# EAGLE board flipchip (EAGLE 6.6.0), part 1 of 2
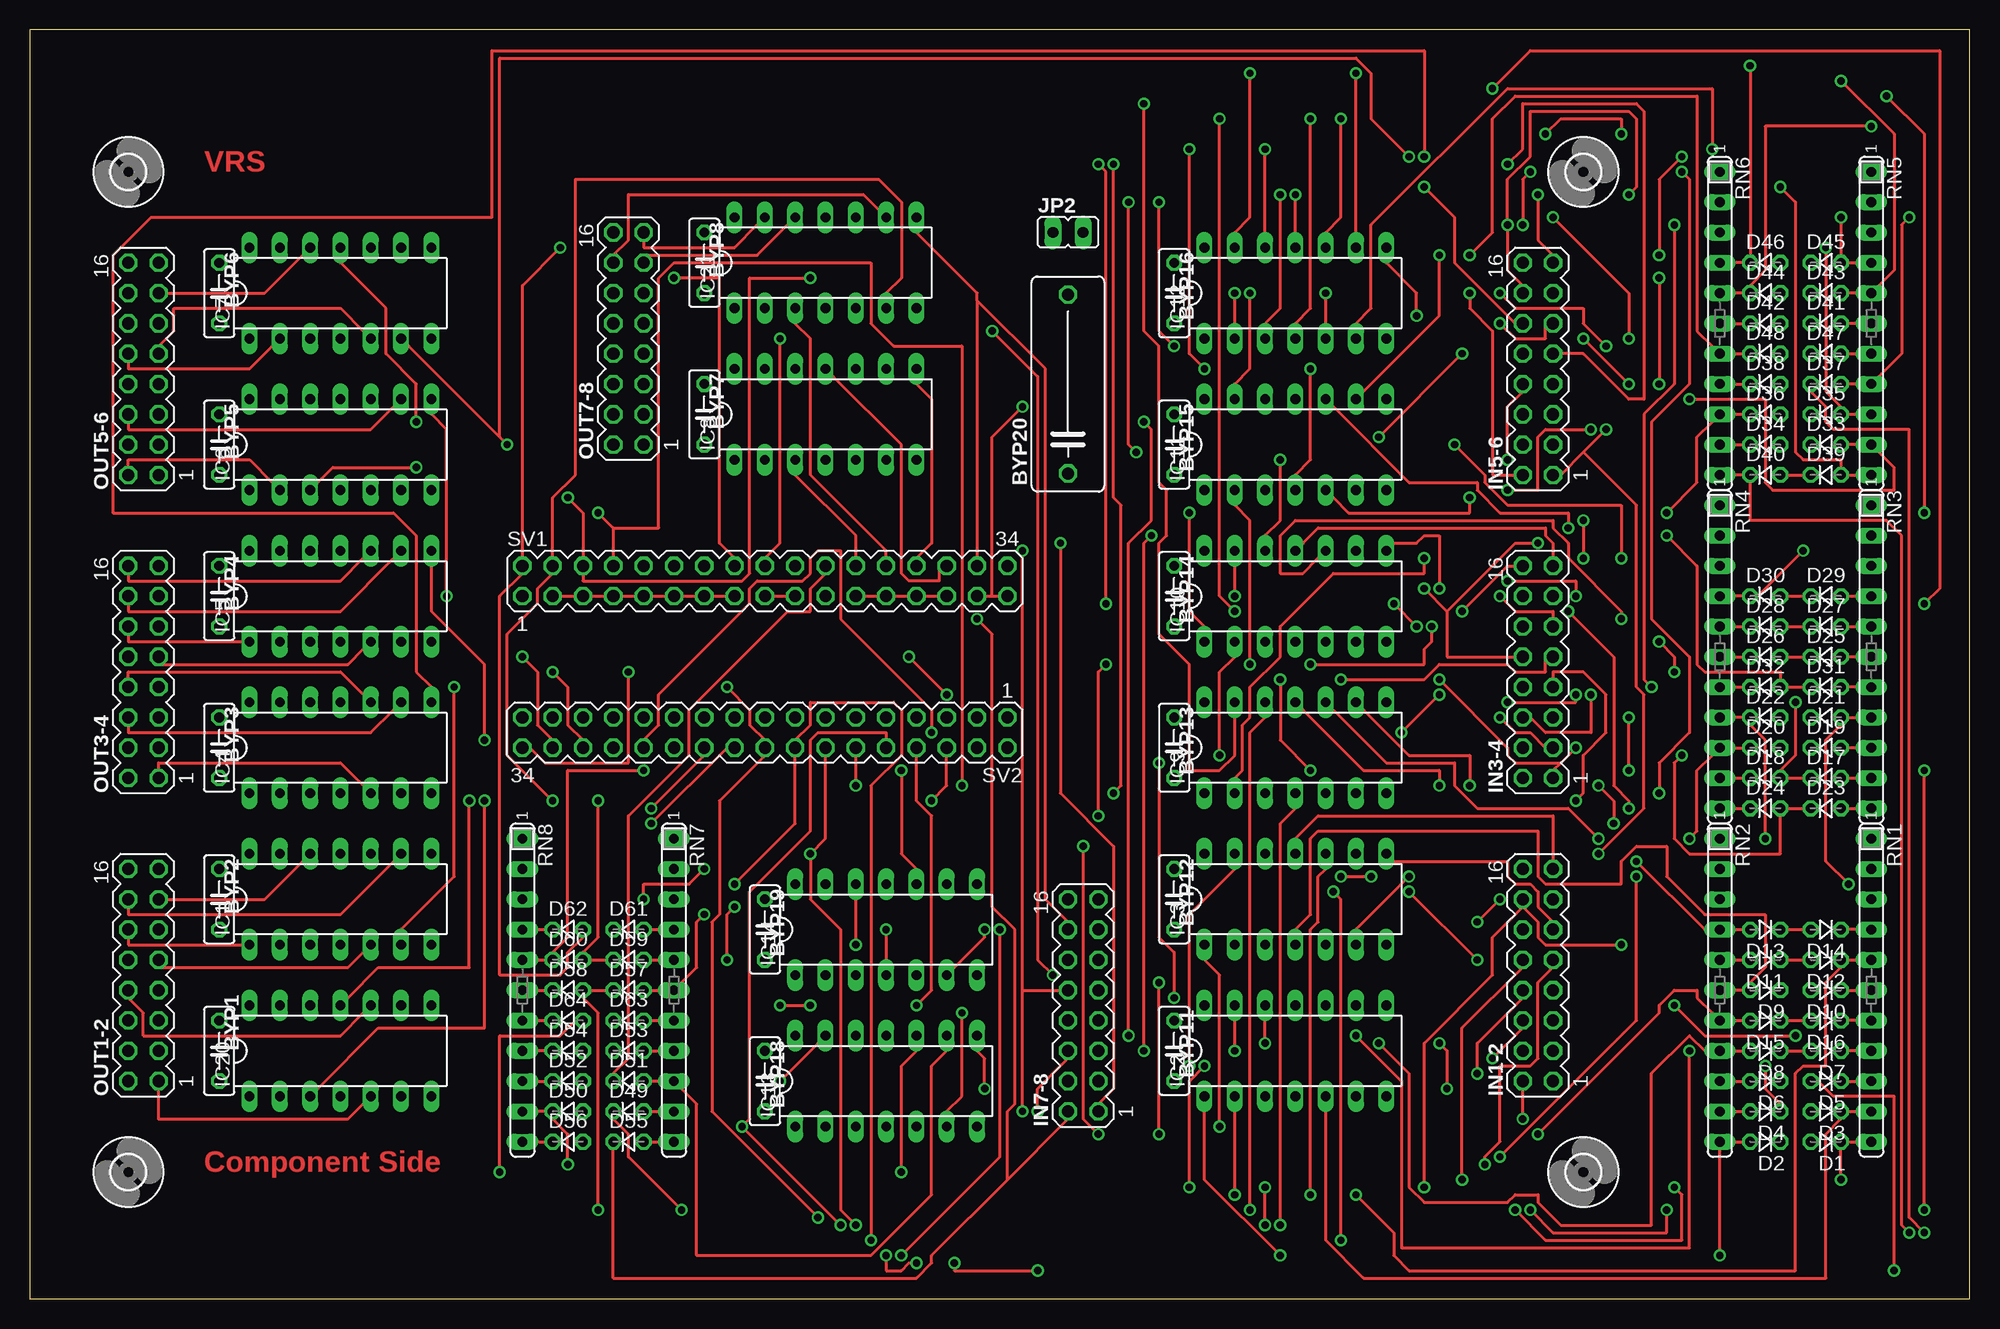
[diagram p2: board, top side]
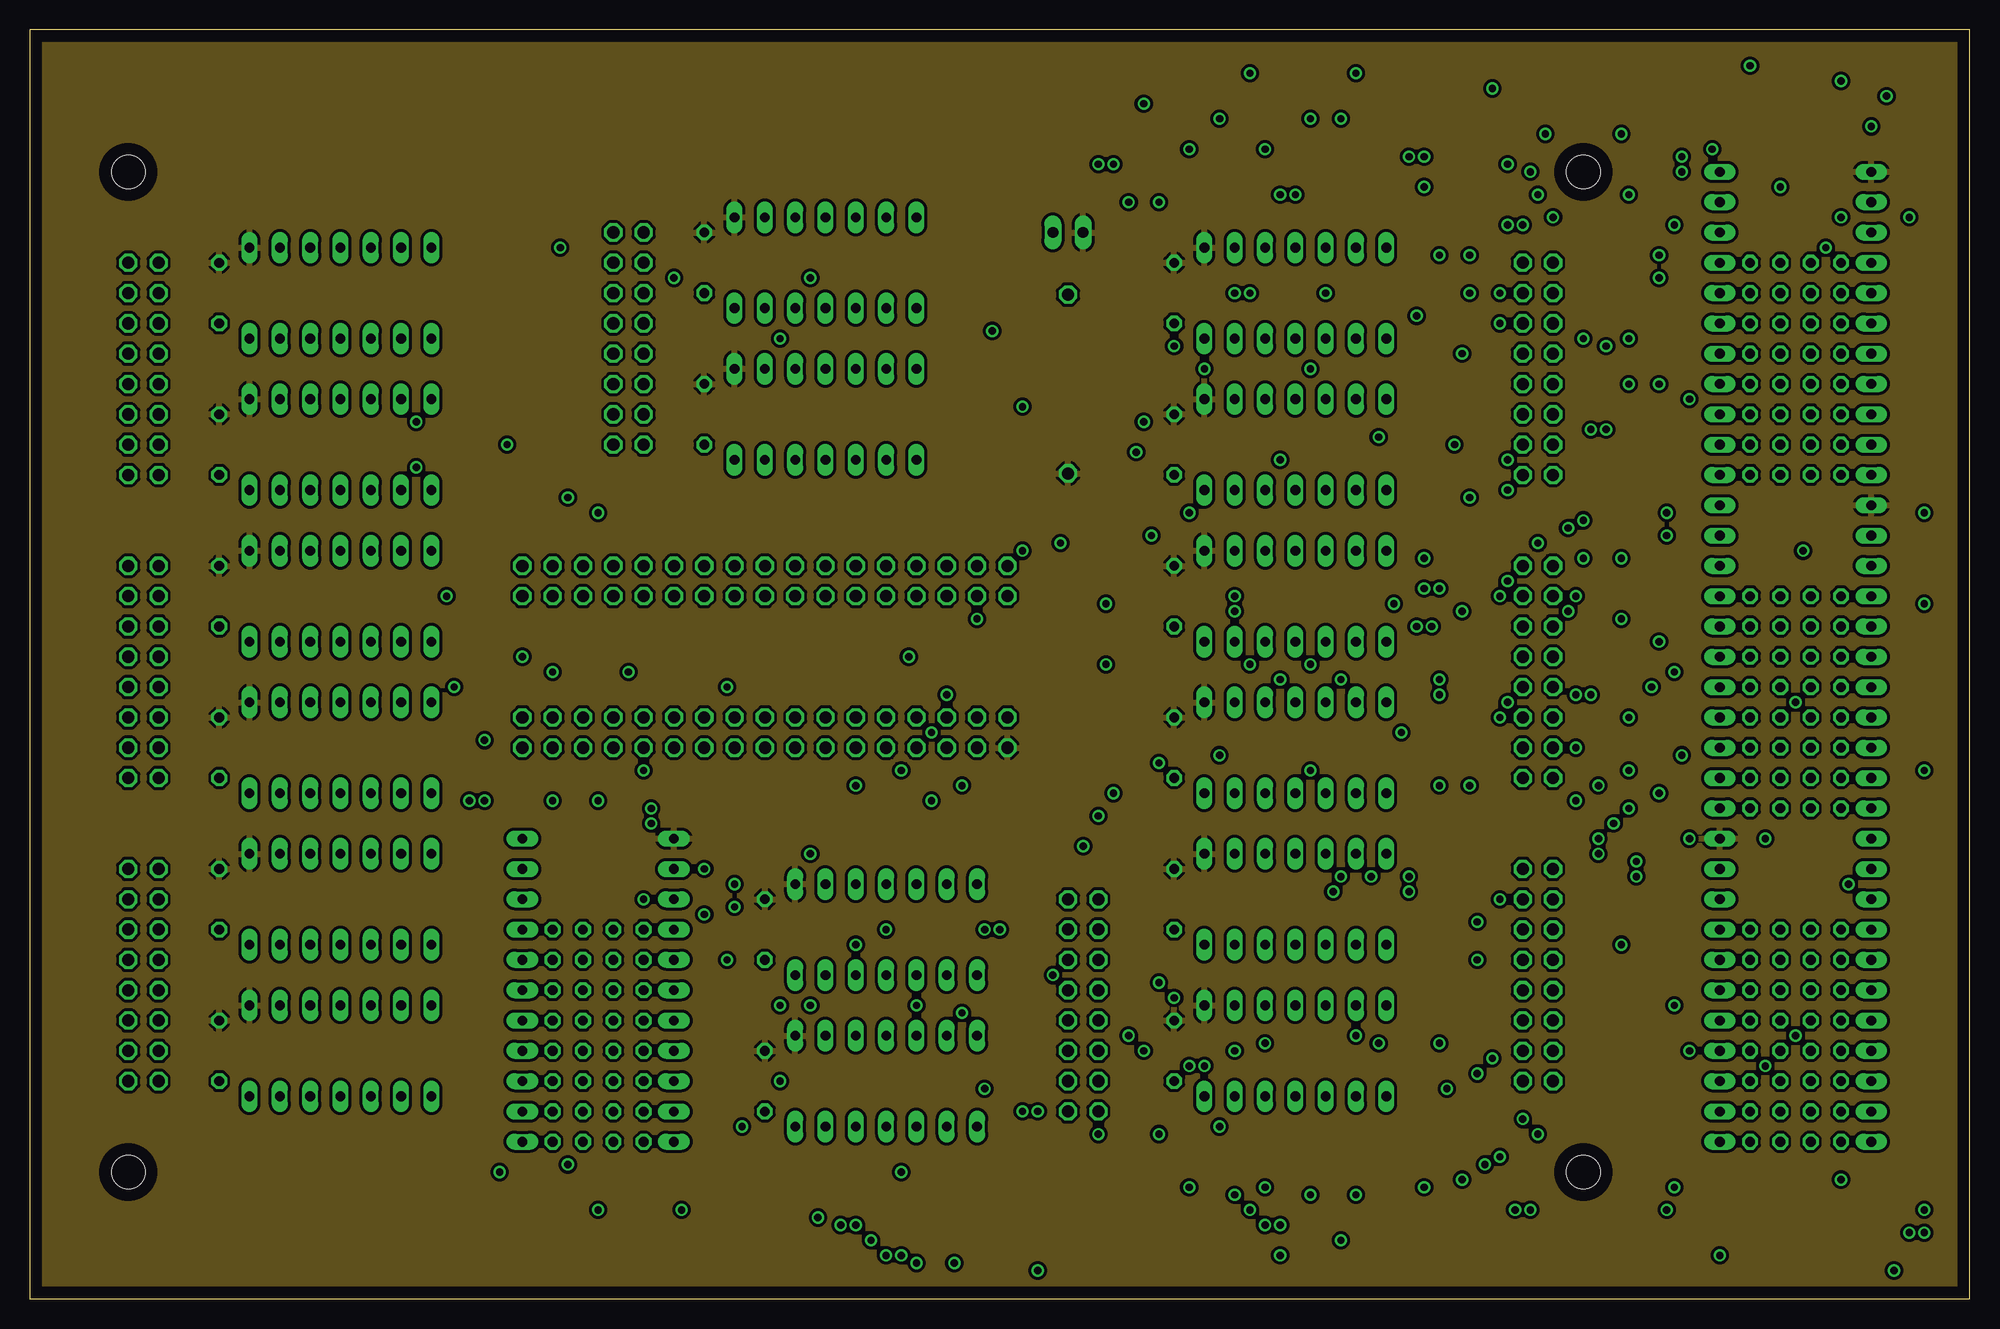
[diagram p3: board, inner layer VCC$]
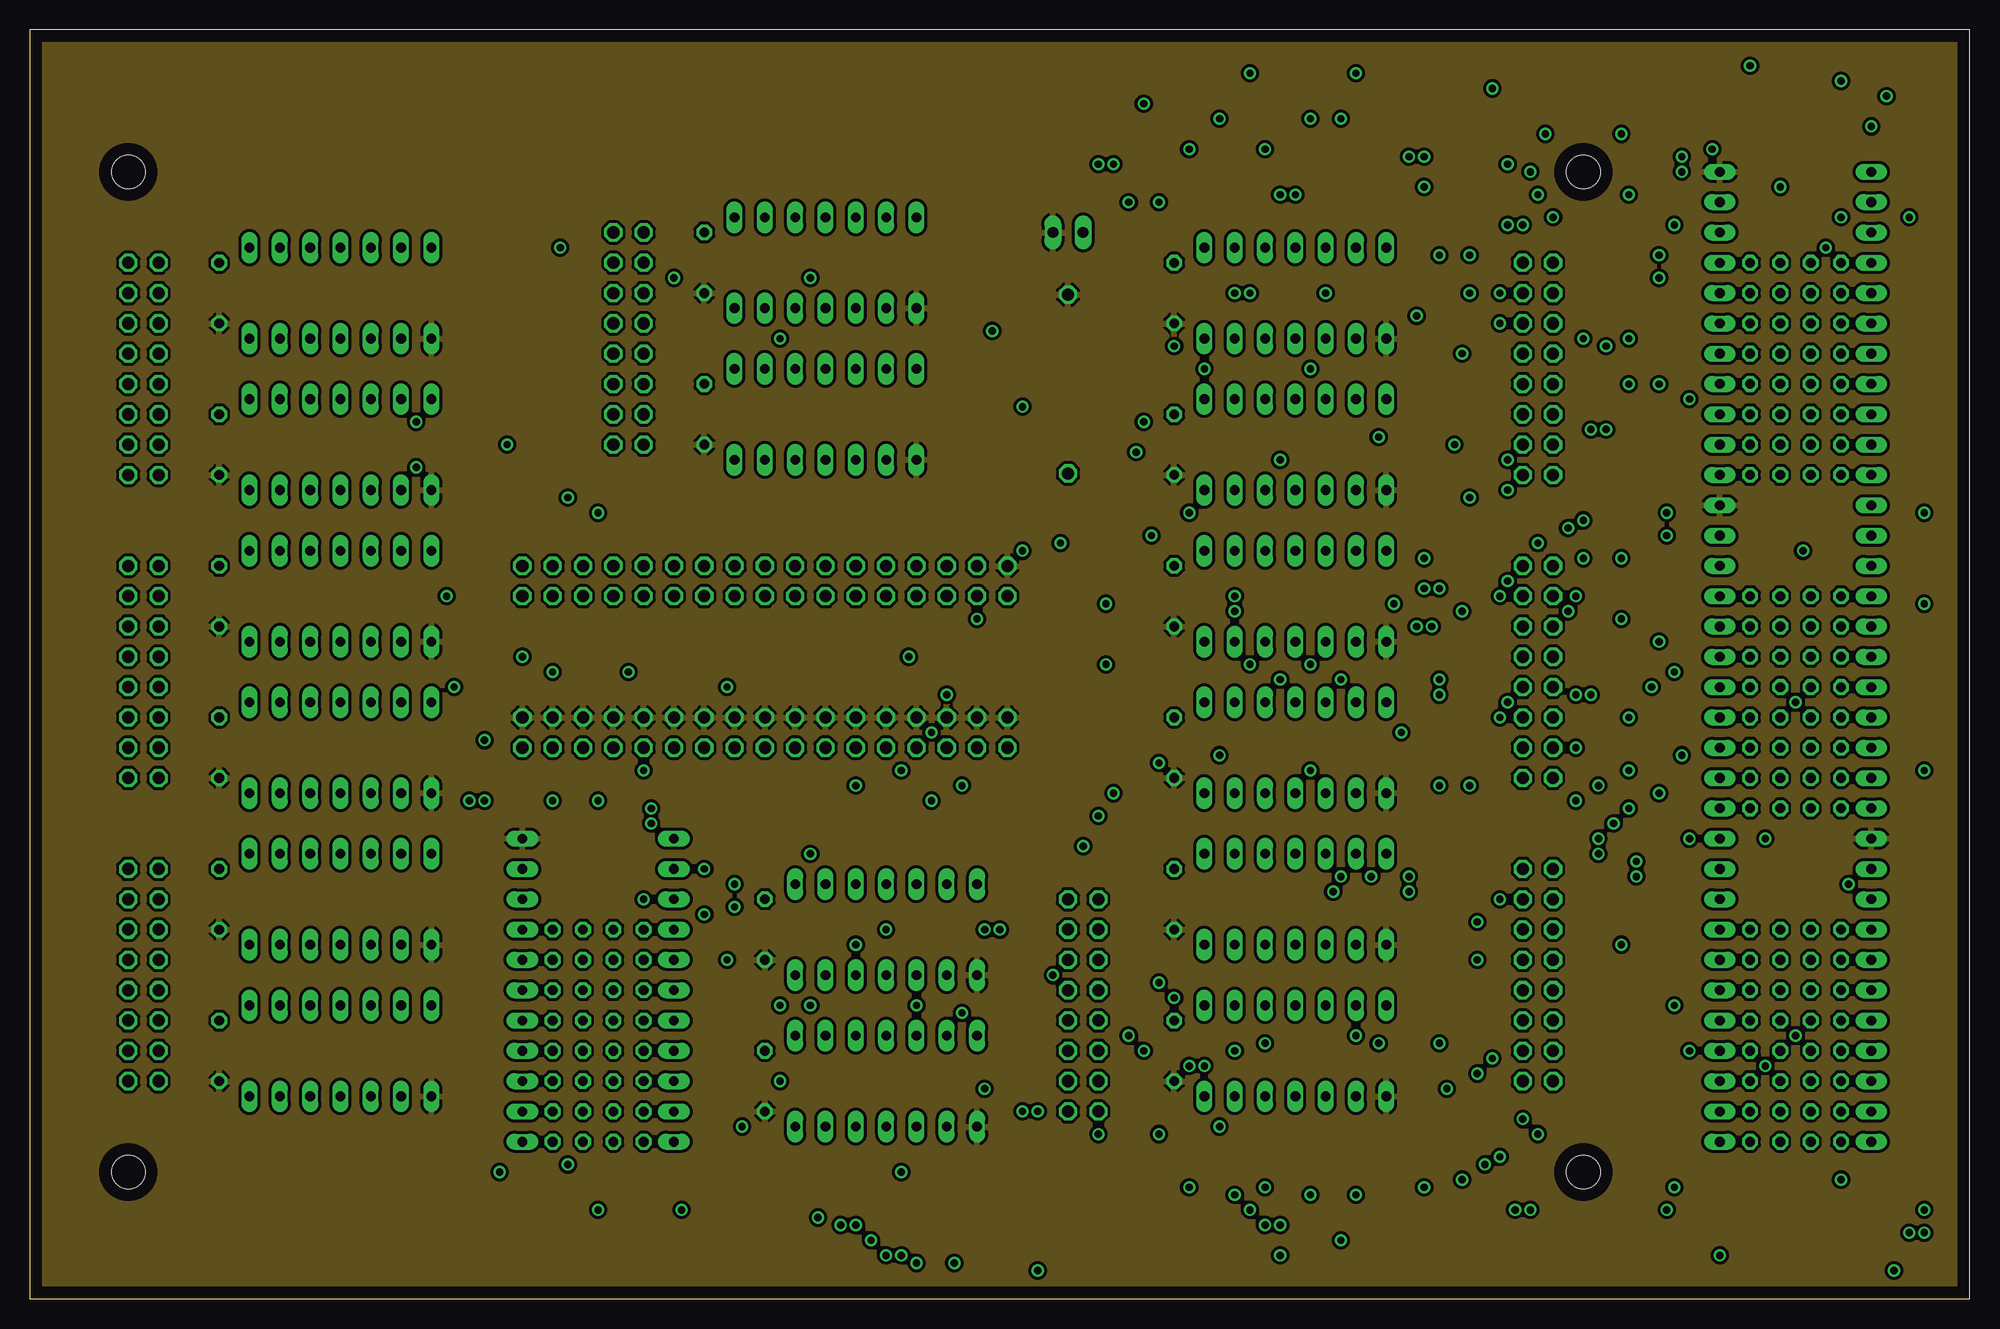
[diagram p4: board, inner layer GND$]
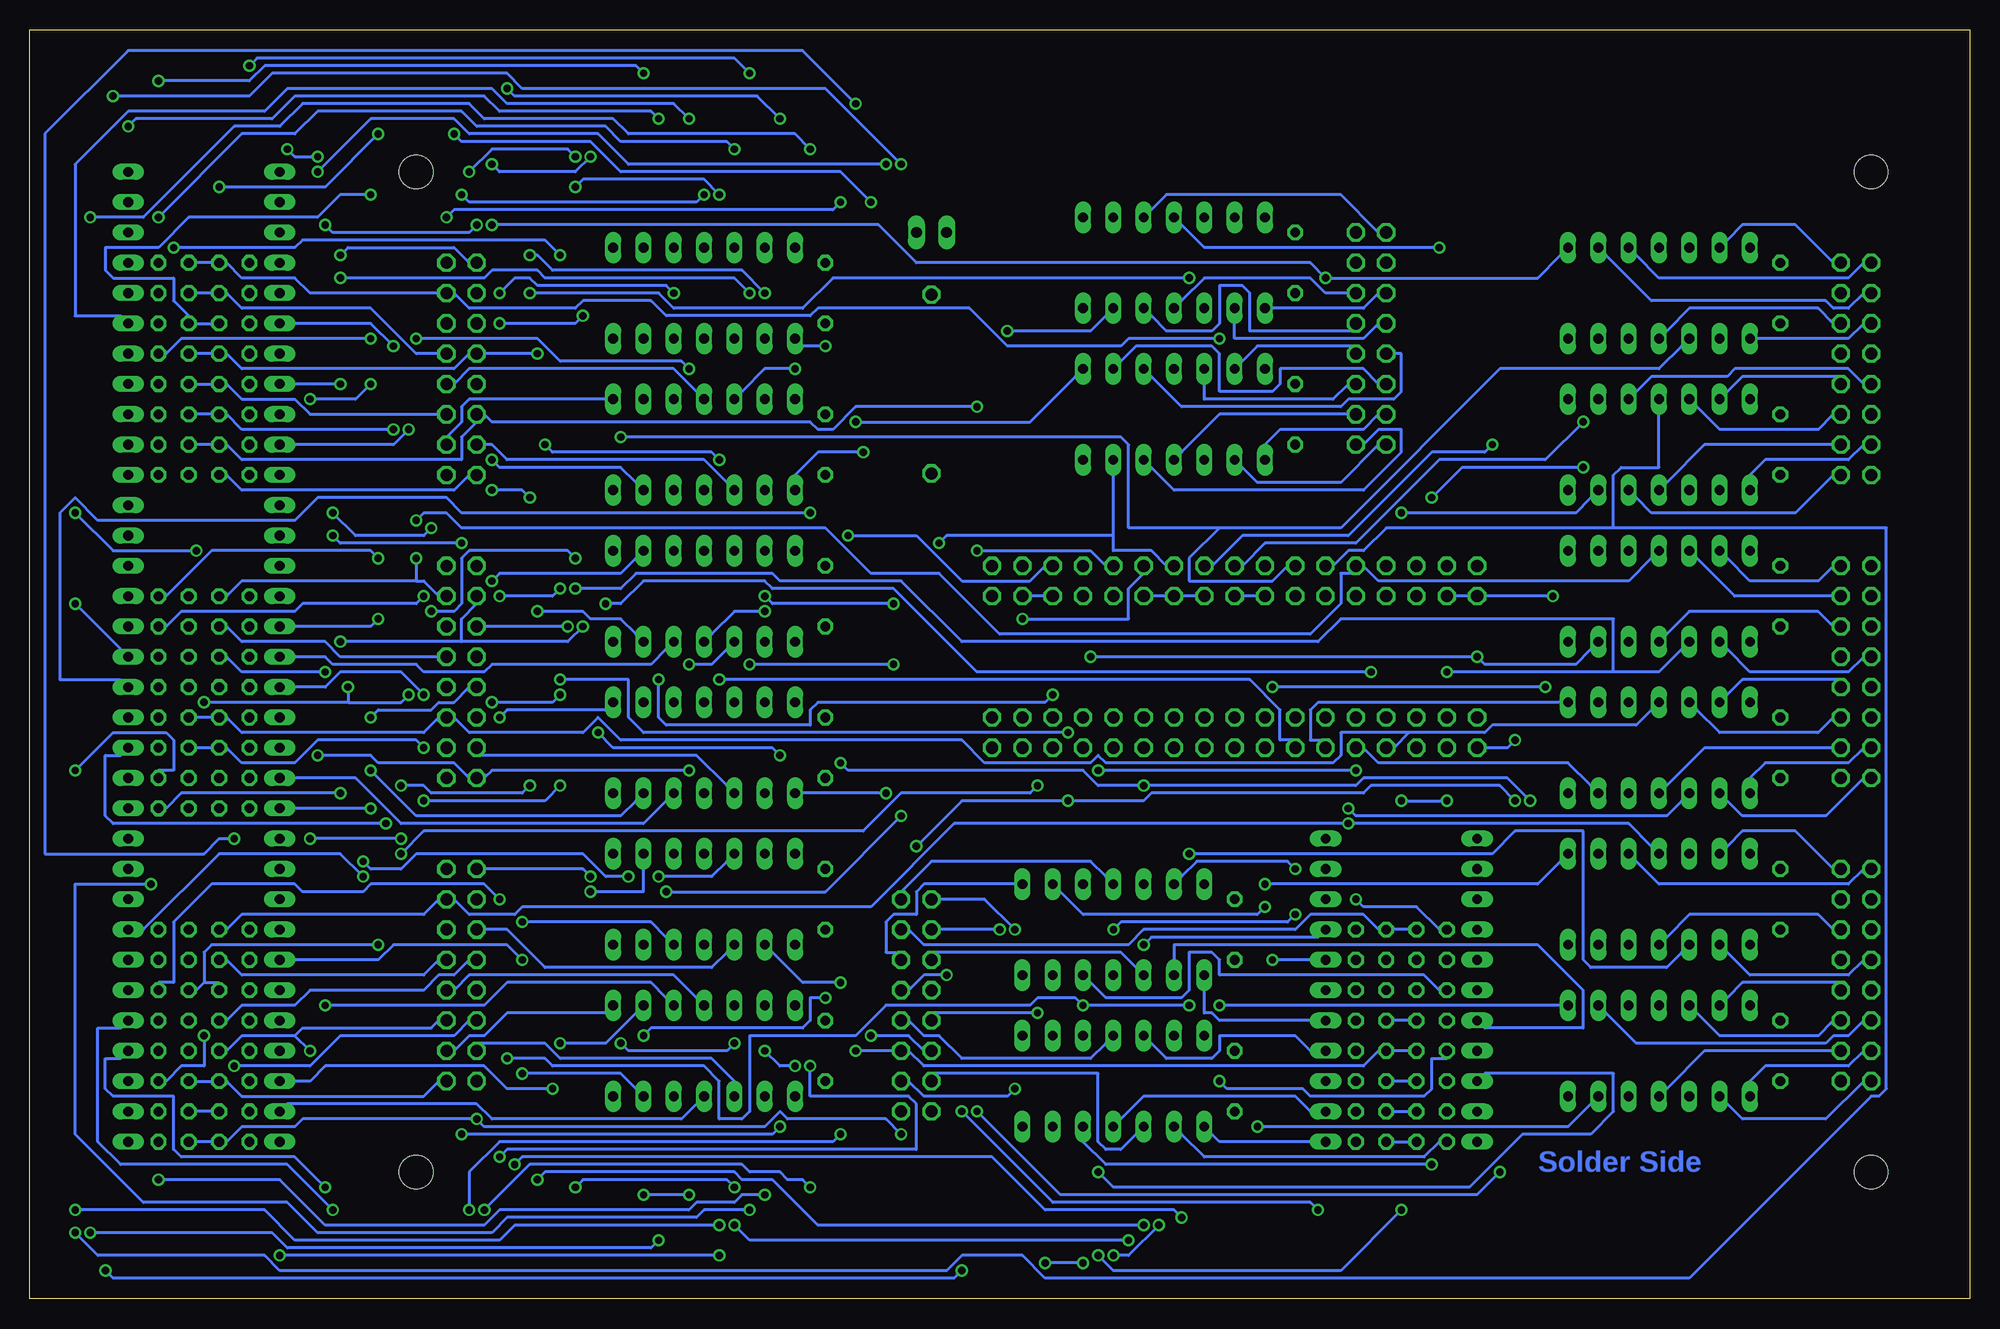
[diagram p5: board, bottom side, seen from below]

Size 162.54 x 106.35 mm. Coordinates in mm from the lower left corner, seen from the top.
Outline: 0,0 162.54,0 162.54,106.35 0,106.35 0,0
Copper layers (1*2*15*16): Top 0.035mm / dielectric 1.5mm / VCC$ 0.035mm / dielectric 0.15mm / GND$ 0.035mm / dielectric 0.2mm / Bottom 0.035mm
Design rules "olimex10mil *": minimum track width 10mil, minimum drill 24mil, track to track 10mil, track to pad 10mil, pad to pad 10mil, via to via 10mil, smd to smd 10mil, copper to edge 40mil, drill to drill 10mil, minimum pad ring 10mil, minimum via ring 8mil, stop-mask expansion 0mil, vias tented up to drill 0mil, thermal gap 10mil
Net classes: 1 Power: width 0.508 mm, drill 0.254 mm, clearance 0.254 mm

## Footprints (pad centres in the part's own frame; a part is rotated, then mirrored left to right if it is on the bottom)
C050-025X075 = drill 0.813 octagon: 1 -2.54,0; 2 2.54,0
C150-064X183 = drill 1.016 octagon: 1 -7.493,0; 2 7.493,0
D-2.5 = drill 0.813 octagon: A 1.27,0; C -1.27,0
DIL14 = drill 0.813 long: 1 -7.62,-3.81; 2 -5.08,-3.81; 3 -2.54,-3.81; 4 0,-3.81; 5 2.54,-3.81; 6 5.08,-3.81; 7 7.62,-3.81; 8 7.62,3.81; 9 5.08,3.81; 10 2.54,3.81; 11 0,3.81; 12 -2.54,3.81; 13 -5.08,3.81; 14 -7.62,3.81
MA08-2 = drill 1.016 octagon: 1 -8.89,-1.27; 2 -8.89,1.27; 3 -6.35,-1.27; 4 -6.35,1.27; 5 -3.81,-1.27; 6 -3.81,1.27; 7 -1.27,-1.27; 8 -1.27,1.27; 9 1.27,-1.27; 10 1.27,1.27; 11 3.81,-1.27; 12 3.81,1.27; 13 6.35,-1.27; 14 6.35,1.27; 15 8.89,-1.27; 16 8.89,1.27
JP1 = drill 0.914 long: 1 0,-1.27; 2 0,1.27
SIL11 = drill 0.813 long: 1 -12.7,0; 2 -10.16,0; 3 -7.62,0; 4 -5.08,0; 5 -2.54,0; 6 0,0; 7 2.54,0; 8 5.08,0; 9 7.62,0; 10 10.16,0; 11 12.7,0
MA17-2 = drill 1.016 octagon: 1 -20.32,-1.27; 2 -20.32,1.27; 3 -17.78,-1.27; 4 -17.78,1.27; 5 -15.24,-1.27; 6 -15.24,1.27; 7 -12.7,-1.27; 8 -12.7,1.27; 9 -10.16,-1.27; 10 -10.16,1.27; 11 -7.62,-1.27; 12 -7.62,1.27; 13 -5.08,-1.27; 14 -5.08,1.27; 15 -2.54,-1.27; 16 -2.54,1.27; 17 0,-1.27; 18 0,1.27; 19 2.54,-1.27; 20 2.54,1.27; 21 5.08,-1.27; 22 5.08,1.27; 23 7.62,-1.27; 24 7.62,1.27; 25 10.16,-1.27; 26 10.16,1.27; 27 12.7,-1.27; 28 12.7,1.27; 29 15.24,-1.27; 30 15.24,1.27; 31 17.78,-1.27; 32 17.78,1.27; 33 20.32,-1.27; 34 20.32,1.27
2,8 = hole 2.8: 0,0

## Placement (x,y rotation side)
BYP1  0.1uf  [C050-025X075]  15.87,20.79 270 top
BYP2  0.1uf  [C050-025X075]  15.87,33.49 270 top
BYP3  0.1uf  [C050-025X075]  15.87,46.19 270 top
BYP4  0.1uf  [C050-025X075]  15.87,58.89 270 top
BYP5  0.1uf  [C050-025X075]  15.87,71.59 270 top
BYP6  0.1uf  [C050-025X075]  15.87,84.29 270 top
BYP7  0.1uf  [C050-025X075]  56.51,74.13 270 top
BYP8  0.1uf  [C050-025X075]  56.51,86.83 270 top
BYP11  0.1uf  [C050-025X075]  95.88,20.79 270 top
BYP12  0.1uf  [C050-025X075]  95.88,33.49 270 top
BYP13  0.1uf  [C050-025X075]  95.88,46.19 270 top
BYP14  0.1uf  [C050-025X075]  95.88,58.89 270 top
BYP15  0.1uf  [C050-025X075]  95.88,71.59 270 top
BYP16  0.1uf  [C050-025X075]  95.88,84.29 270 top
BYP18  0.1uf  [C050-025X075]  61.59,18.25 270 top
BYP19  0.1uf  [C050-025X075]  61.59,30.95 270 top
BYP20  100uf 25V  [C150-064X183]  86.99,76.67 90 top
D1  [D-2.5]  150.49,13.17 180 top
D2  [D-2.5]  145.41,13.17 180 top
D3  [D-2.5]  150.49,15.71 180 top
D4  [D-2.5]  145.41,15.71 180 top
D5  [D-2.5]  150.49,18.25 180 top
D6  [D-2.5]  145.41,18.25 180 top
D7  [D-2.5]  150.49,20.79 180 top
D8  [D-2.5]  145.41,20.79 180 top
D9  [D-2.5]  145.41,25.87 180 top
D10  [D-2.5]  150.49,25.87 180 top
D11  [D-2.5]  145.41,28.41 180 top
D12  [D-2.5]  150.49,28.41 180 top
D13  [D-2.5]  145.41,30.95 180 top
D14  [D-2.5]  150.49,30.95 180 top
D15  [D-2.5]  145.41,23.33 180 top
D16  [D-2.5]  150.49,23.33 180 top
D17  [D-2.5]  150.49,43.65 0 top
D18  [D-2.5]  145.41,43.65 0 top
D19  [D-2.5]  150.49,46.19 0 top
D20  [D-2.5]  145.41,46.19 0 top
D21  [D-2.5]  150.49,48.73 0 top
D22  [D-2.5]  145.41,48.73 0 top
D23  [D-2.5]  150.49,41.11 0 top
D24  [D-2.5]  145.41,41.11 0 top
D25  [D-2.5]  150.49,53.81 0 top
D26  [D-2.5]  145.41,53.81 0 top
D27  [D-2.5]  150.49,56.35 0 top
D28  [D-2.5]  145.41,56.35 0 top
D29  [D-2.5]  150.49,58.89 0 top
D30  [D-2.5]  145.41,58.89 0 top
D31  [D-2.5]  150.49,51.27 0 top
D32  [D-2.5]  145.41,51.27 0 top
D33  [D-2.5]  150.49,71.59 0 top
D34  [D-2.5]  145.41,71.59 0 top
D35  [D-2.5]  150.49,74.13 0 top
D36  [D-2.5]  145.41,74.13 0 top
D37  [D-2.5]  150.49,76.67 0 top
D38  [D-2.5]  145.41,76.67 0 top
D39  [D-2.5]  150.49,69.05 0 top
D40  [D-2.5]  145.41,69.05 0 top
D41  [D-2.5]  150.49,81.75 0 top
D42  [D-2.5]  145.41,81.75 0 top
D43  [D-2.5]  150.49,84.29 0 top
D44  [D-2.5]  145.41,84.29 0 top
D45  [D-2.5]  150.49,86.83 0 top
D46  [D-2.5]  145.41,86.83 0 top
D47  [D-2.5]  150.49,79.21 0 top
D48  [D-2.5]  145.41,79.21 0 top
D49  [D-2.5]  50.16,15.71 0 top
D50  [D-2.5]  45.08,15.71 0 top
D51  [D-2.5]  50.16,18.25 0 top
D52  [D-2.5]  45.08,18.25 0 top
D53  [D-2.5]  50.16,20.79 0 top
D54  [D-2.5]  45.08,20.79 0 top
D55  [D-2.5]  50.16,13.17 0 top
D56  [D-2.5]  45.08,13.17 0 top
D57  [D-2.5]  50.16,25.87 0 top
D58  [D-2.5]  45.08,25.87 0 top
D59  [D-2.5]  50.16,28.41 0 top
D60  [D-2.5]  45.08,28.41 0 top
D61  [D-2.5]  50.16,30.95 0 top
D62  [D-2.5]  45.08,30.95 0 top
D63  [D-2.5]  50.16,23.33 0 top
D64  [D-2.5]  45.08,23.33 0 top
IC1  74LS125N  [DIL14]  26.03,33.49 0 top
IC2  74LS86N  [DIL14]  106.04,20.79 0 top
IC3  74LS86N  [DIL14]  106.04,33.49 0 top
IC4  74LS125N  [DIL14]  26.03,46.19 0 top
IC5  74LS125N  [DIL14]  26.03,58.89 0 top
IC6  74LS125N  [DIL14]  26.03,71.59 0 top
IC7  74LS125N  [DIL14]  26.03,84.29 0 top
IC8  74LS125N  [DIL14]  66.67,74.13 0 top
IC9  74LS86N  [DIL14]  106.04,46.19 0 top
IC10  74LS86N  [DIL14]  106.04,58.89 0 top
IC11  74LS86N  [DIL14]  106.04,71.59 0 top
IC12  74LS86N  [DIL14]  106.04,84.29 0 top
IC13  74LS86N  [DIL14]  71.75,18.25 0 top
IC14  74LS86N  [DIL14]  71.75,30.95 0 top
IC20  74LS125N  [DIL14]  26.03,20.79 0 top
IC21  74LS125N  [DIL14]  66.67,86.83 0 top
IN1-2  [MA08-2]  126.36,27.14 90 top
IN3-4  [MA08-2]  126.36,52.54 90 top
IN5-6  [MA08-2]  126.36,77.94 90 top
IN7-8  [MA08-2]  88.26,24.6 90 top
JP2  POWER  [JP1]  86.99,89.37 270 top
OUT1-2  [MA08-2]  9.52,27.14 90 top
OUT3-4  [MA08-2]  9.52,52.54 90 top
OUT5-6  [MA08-2]  9.52,77.94 90 top
OUT7-8  [MA08-2]  50.16,80.48 90 top
RN1  [SIL11]  154.3,25.87 270 top
RN2  [SIL11]  141.6,25.87 270 top
RN3  [SIL11]  154.3,53.81 270 top
RN4  [SIL11]  141.6,53.81 270 top
RN5  [SIL11]  154.3,81.75 270 top
RN6  [SIL11]  141.6,81.75 270 top
RN7  [SIL11]  53.97,25.87 270 top
RN8  [SIL11]  41.27,25.87 270 top
SV1  [MA17-2]  61.59,60.16 0 top
SV2  [MA17-2]  61.59,47.46 180 top
U$1  [2,8]  130.17,10.63 0 top
U$2  [2,8]  130.17,94.45 0 top
U$3  [2,8]  8.25,94.45 0 top
U$4  [2,8]  8.25,10.63 0 top